# EAGLE design ProgramHeader (EAGLE 5.04)
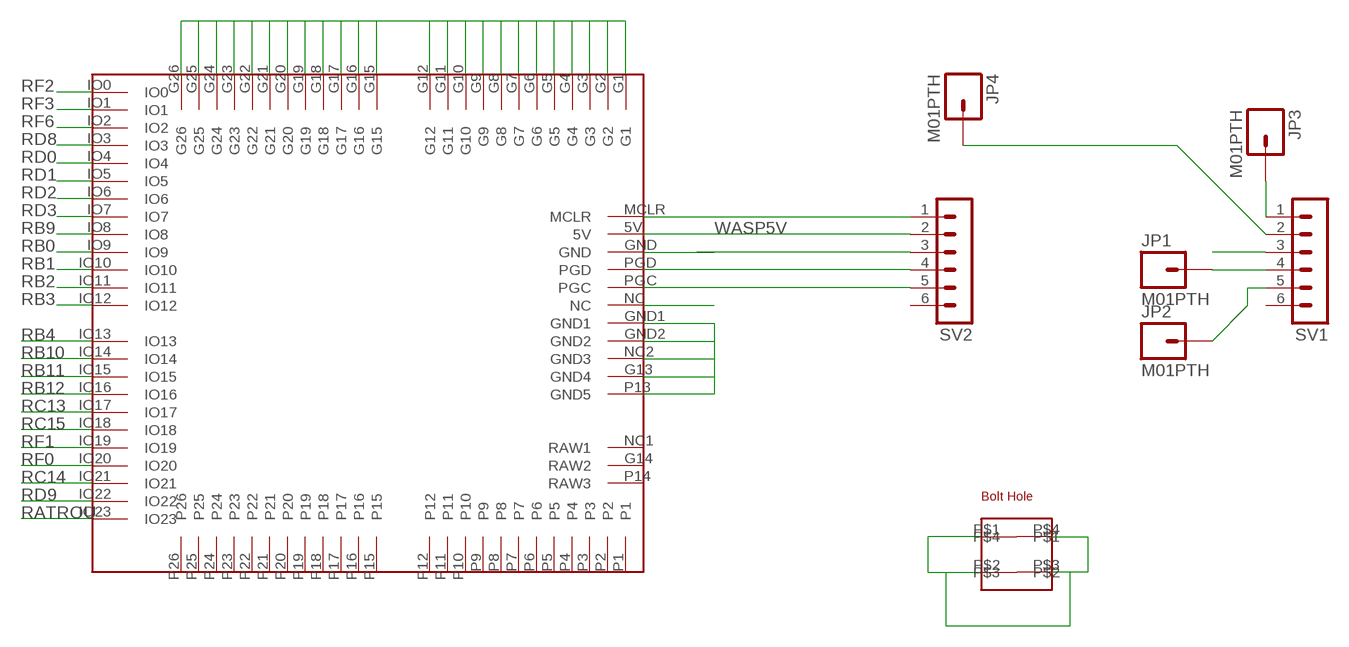
[diagram p0: schematic, sheet 1]

## Parts
JP1  M01PTH  [1X01]
JP2  M01PTH  [1X01]
JP3  M01PTH  [1X01]
JP4  M01PTH  [1X01]
SV1  MA06-1  [MA06-1]
SV2  MA06-1  [MA06-1]
U$1  SUB_DEV_2  [SUB_DEV_2]
U$5  BOLT_HOLEHOLES-OUTLINE  [HOLES]

## Nets
32PGC: JP2.1 SV1.5
#MCLR: SV2.1 U$1.MCLR
GND: SV1.3 SV2.3 U$1.G1 U$1.G2 U$1.G3 U$1.G4 U$1.G5 U$1.G6 U$1.G7 U$1.G8 U$1.G9 U$1.G10 U$1.G11 U$1.G12 U$1.G13(GND4) U$1.G15 U$1.G16 U$1.G17 U$1.G18 U$1.G19 U$1.G20 U$1.G21 U$1.G22 U$1.G23 U$1.G24 U$1.G25 U$1.G26 U$1.GND U$1.GND1 U$1.GND2 U$1.NC2(GND3) U$1.P13(GND5) U$5.P$1 U$5.P$2 U$5.P$3 U$5.P$4
N$3: JP4.1 SV1.2
N$4: JP3.1 SV1.1
N$5: JP1.1 SV1.4
NC: U$1.NC
PGC: SV2.5 U$1.PGC
PGD: SV2.4 U$1.PGD
RATROU: U$1.IO23
RB0: U$1.IO9
RB1: U$1.IO10
RB2: U$1.IO11
RB3: U$1.IO12
RB4: U$1.IO13
RB9: U$1.IO8
RB10: U$1.IO14
RB11: U$1.IO15
RB12: U$1.IO16
RC13: U$1.IO17
RC14: U$1.IO21
RC15: U$1.IO18
RD0: U$1.IO4
RD1: U$1.IO5
RD2: U$1.IO6
RD3: U$1.IO7
RD8: U$1.IO3
RD9: U$1.IO22
RF0: U$1.IO20
RF1: U$1.IO19
RF2: U$1.IO0
RF3: U$1.IO1
RF6: U$1.IO2
WASP5V: SV2.2 U$1.5V
Unconnected: SV1.6 SV2.6 U$1.G14(RAW2) U$1.NC1(RAW1) U$1.P1 U$1.P2 U$1.P3 U$1.P4 U$1.P5 U$1.P6 U$1.P7 U$1.P8 U$1.P9 U$1.P10 U$1.P11 U$1.P12 U$1.P14(RAW3) U$1.P15 U$1.P16 U$1.P17 U$1.P18 U$1.P19 U$1.P20 U$1.P21 U$1.P22 U$1.P23 U$1.P24 U$1.P25 U$1.P26

## Library data of the parts
JP1-JP4 = SparkFun:M01: Header 1 Standard 1-pin 0.1" header. Use with straight break away headers (SKU : PRT-00116), right angle break away headers (PRT-00553), swiss pins (PRT-00743), machine pins (PRT-00117), and female headers (PRT-00115).
SV1 SV2 = con-lstb:MA06-1: PIN HEADER
U$1 = WASP:SUB_DEV_2
U$5 = WASP:BOLT_HOLE

## Board
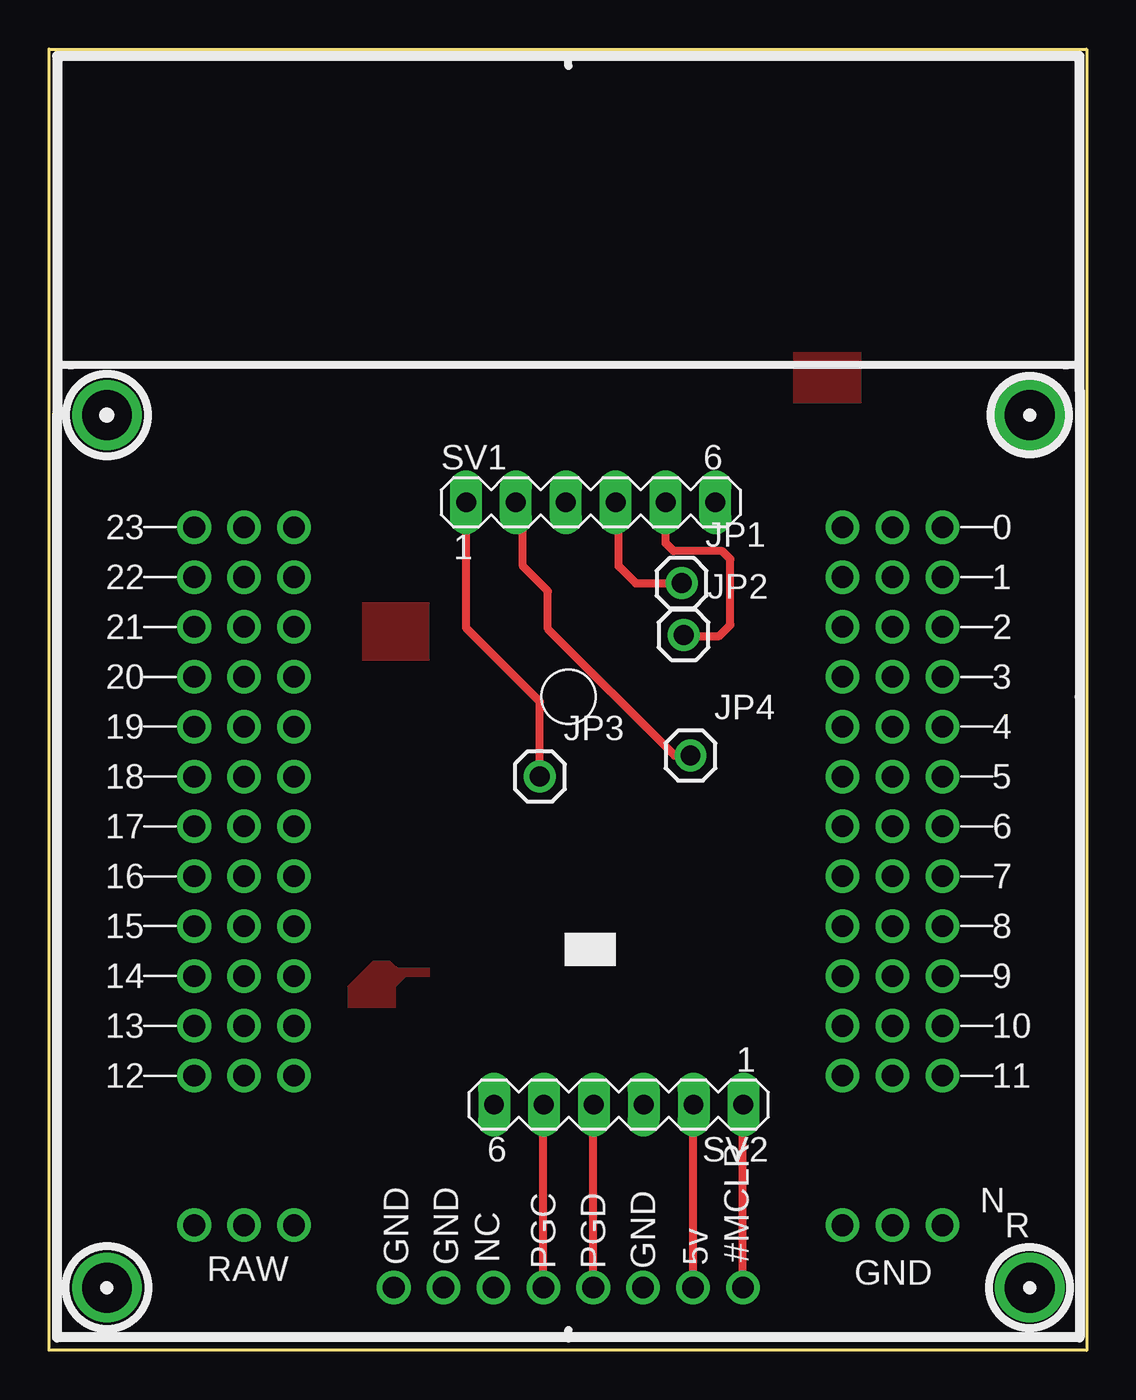
[diagram p1: board, top side]
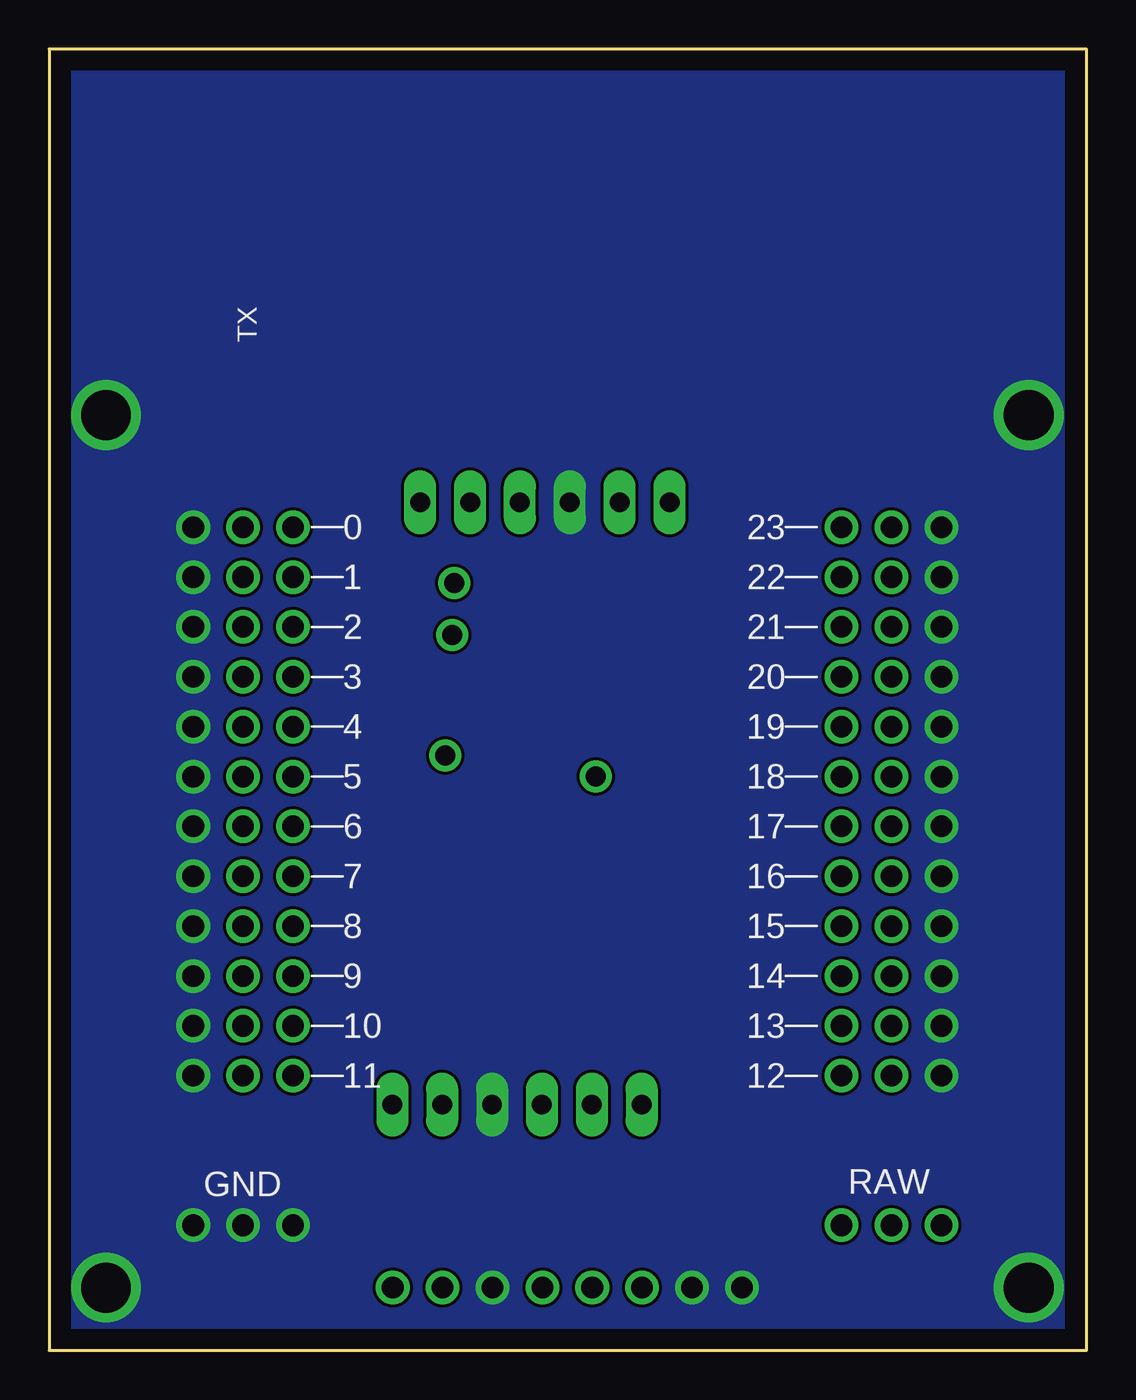
[diagram p2: board, bottom side, seen from below]

Size 52.83 x 66.29 mm. Coordinates in mm from the lower left corner, seen from the top.
Outline: 0,66.29 52.83,66.29 52.83,0 0,0 0,66.29
Copper layers (1*16): Top 0.035mm / dielectric 1.5mm / Bottom 0.035mm
Design rules "default *": minimum track width 8mil, minimum drill 15mil, track to track 6mil, track to pad 6mil, pad to pad 6mil, via to via 6mil, smd to smd 6mil, copper to edge 40mil, drill to drill 6mil, minimum pad ring 12mil, minimum via ring 12mil, stop-mask expansion 4mil, vias tented up to drill 25mil, thermal gap 0mil

### Footprints (pad centres in the part's own frame; a part is rotated, then mirrored left to right if it is on the bottom)
1X01 = drill 1.016 round: 1 0,0
MA06-1 = drill 1.016 long: 1 -6.35,0; 2 -3.81,0; 3 -1.27,0; 4 1.27,0; 5 3.81,0; 6 6.35,0
SUB_DEV_2 = drill 1.1 round: 5V 44.45,28.575; G1 5.715,41.275; G2 8.255,41.275; G3 10.795,41.275; G4 13.335,41.275; G5 15.875,41.275; G6 18.415,41.275; G7 20.955,41.275; G8 23.495,41.275; G9 26.035,41.275; G10 28.575,41.275; G11 31.115,41.275; G12 33.655,41.275; G13 41.275,41.275; G14 41.275,3.175; G15 33.655,3.175; G16 31.115,3.175; G17 28.575,3.175; G18 26.035,3.175; G19 23.495,3.175; G20 20.955,3.175; G21 18.415,3.175; G22 15.875,3.175; G23 13.335,3.175; G24 10.795,3.175; G25 8.255,3.175; G26 5.715,3.175; GND 44.45,26.035; GND1 44.45,15.875; GND2 44.45,13.335; IO0 5.715,36.195; IO1 8.255,36.195; IO2 10.795,36.195; IO3 13.335,36.195; IO4 15.875,36.195; IO5 18.415,36.195; IO6 20.955,36.195; IO7 23.495,36.195; IO8 26.035,36.195; IO9 28.575,36.195; IO10 31.115,36.195; IO11 33.655,36.195; IO12 33.655,8.255; IO13 31.115,8.255; IO14 28.575,8.255; IO15 26.035,8.255; IO16 23.495,8.255; IO17 20.955,8.255; IO18 18.415,8.255; IO19 15.875,8.255; IO20 13.335,8.255; IO21 10.795,8.255; IO22 8.255,8.255; IO23 5.715,8.255; MCLR 44.45,31.115; NC 44.45,18.415; NC1 41.275,8.255; NC2 41.275,36.195; P1 5.715,38.735; P2 8.255,38.735; P3 10.795,38.735; P4 13.335,38.735; P5 15.875,38.735; P6 18.415,38.735; P7 20.955,38.735; P8 23.495,38.735; P9 26.035,38.735; P10 28.575,38.735; P11 31.115,38.735; P12 33.655,38.735; P13 41.275,38.735; P14 41.275,5.715; P15 33.655,5.715; P16 31.115,5.715; P17 28.575,5.715; P18 26.035,5.715; P19 23.495,5.715; P20 20.955,5.715; P21 18.415,5.715; P22 15.875,5.715; P23 13.335,5.715; P24 10.795,5.715; P25 8.255,5.715; P26 5.715,5.715; PGC 44.45,20.955; PGD 44.45,23.495
HOLES = drill 2.54 round: P$1 0,-44.45; P$2 0,0; P$3 46.99,-44.45; P$4 46.99,0

### Placement (x,y rotation side)
JP1  32.21,39.09 0 top
JP2  32.31,36.45 0 top
JP3  24.99,29.24 0 top
JP4  32.66,30.3 0 top
SV1  27.58,43.21 0 top
SV2  29.01,12.52 180 top
U$1  4.22,47.65 270 top
U$5  49.94,3.2 180 top

### Tracks (layer width: path | path; a pad name or v marks a point on that pad's centre or on a via)
32PGC
  Top 0.406: SV1.5 31.39,41.12 31.8,40.72 34.29,40.72 34.7,40.31 34.7,36.96 34.14,36.4 32.16,36.4 31.85,36.7 32.05,36.7 JP2.1
#MCLR
  Top 0.406: U$1.MCLR 35.33,12.5 SV2.1
GND
  pour Bottom (no thermals): 0.33,65.91 30.35,66.04 34.9,66.14 52.45,65.89 52.45,0.69 0.86,0.69 0.36,65.76
  pour Top: 17.63,17.45 15.24,17.45 15.24,18.57 16.51,19.84 17.32,19.84 17.73,19.48 19.35,19.48 19.35,19.02 18.14,19.02 17.63,18.52
  pour Top: 19.3,38.07 15.95,38.07 15.95,35.18 19.35,35.18 19.35,38.07
  pour Top: 41.35,50.83 37.9,50.83 37.9,48.29 41.35,48.29
N$3
  Top 0.406: JP4.1 31.85,30.3 25.4,36.75 25.4,38.68 24.13,39.95 24.13,42.85 SV1.2
N$4
  Top 0.406: JP3.1 24.99,33.05 21.23,36.8 SV1.1
N$5
  Top 0.406: JP1.1 29.87,39.09 29.01,39.95 29.01,43.05 SV1.4
PGC
  Top 0.406: U$1.PGC 25.17,12.5 SV2.5
PGD
  Top 0.406: U$1.PGD 27.71,12.5 SV2.4
WASP5V
  Top 0.406: U$1.5V 32.79,12.5 SV2.2

### Text on the board
bPlace: TX
tValues: WASP Connector | Power 6.6 to 12v